# Altium schematic sheet Memory.SchDoc
size A; SheetNumber: 2; SheetTotal: 6
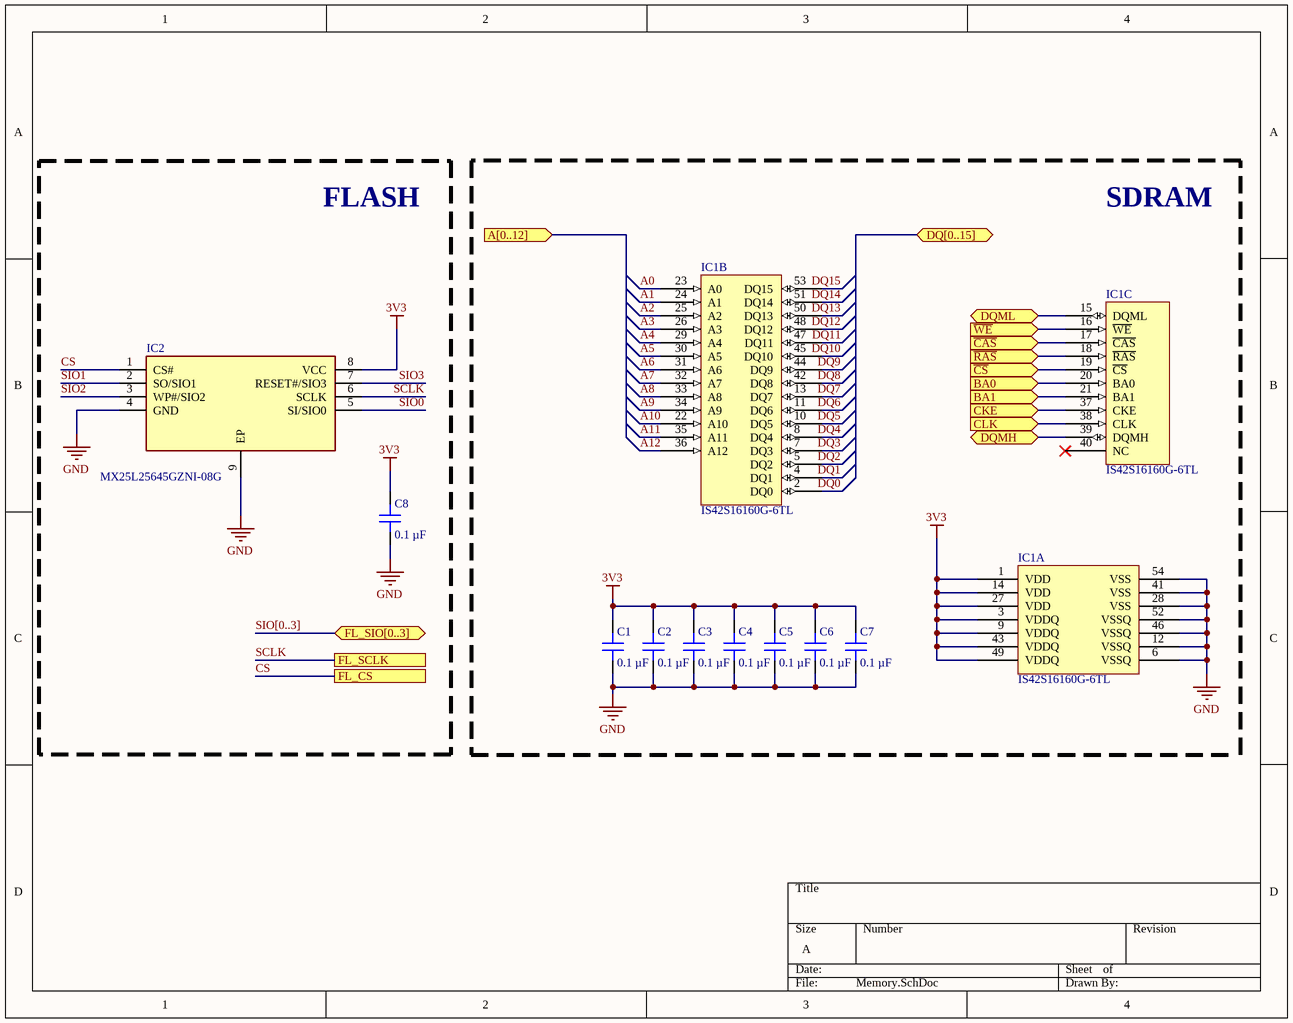
[diagram p0: Memory.SchDoc]

## Parts
C1  0.1 µF  [CAP 0603_1608]
C2  0.1 µF  [CAP 0603_1608]
C3  0.1 µF  [CAP 0603_1608]
C4  0.1 µF  [CAP 0603_1608]
C5  0.1 µF  [CAP 0603_1608]
C6  0.1 µF  [CAP 0603_1608]
C7  0.1 µF  [CAP 0603_1608]
C8  0.1 µF  [CAP 0603_1608]
IC1  IS42S16160G-6TL  [SOP80P1176X120-54N]  (parts A,B,C of 3)
IC2  MX25L25645GZNI-08G  [SON127P600X500X80-9N-D]

## Blocks framed on the sheet
FLASH: C8 IC2

## Ports
A[0..12] (in, see Motherboard[1A], STM32F7[1A]), BA0 (in, see Motherboard[1A], STM32F7[1A]), BA1 (in, see Motherboard[1A], STM32F7[1A]), CKE (in, see Motherboard[1A], STM32F7[1A]), CLK (in, see Motherboard[1A], STM32F7[1A]), DQ[0..15] (bidir, see Motherboard[1A], STM32F7[1A]), DQMH (bidir, see Motherboard[1A], STM32F7[2A]), DQML (bidir, see Motherboard[1A], STM32F7[2A]), FL_CS (see Motherboard[1B], STM32F7[1A]), FL_SCLK (see Motherboard[1B], STM32F7[1A]), FL_SIO[0..3] (bidir, see Motherboard[1A], STM32F7[1A]), ~{CAS} (in, see Motherboard[1A], STM32F7[2A]), ~{CS} (in, see Motherboard[1A], STM32F7[2A]), ~{RAS} (in, see Motherboard[1A], STM32F7[2A]), ~{WE} (in, see Motherboard[1A], STM32F7[2A])

## Nets
3V3: C1.2 C2.2 C3.2 C4.2 C5.2 C6.2 C7.2 C8.2 IC1.1(VDD) IC1.3(VDDQ) IC1.9(VDDQ) IC1.14(VDD) IC1.27(VDD) IC1.43(VDDQ) IC1.49(VDDQ) IC2.8(VCC)
GND: C1.1 C2.1 C3.1 C4.1 C5.1 C6.1 C7.1 C8.1 IC1.6(VSSQ) IC1.12(VSSQ) IC1.28(VSS) IC1.41(VSS) IC1.46(VSSQ) IC1.52(VSSQ) IC1.54(VSS) IC2.4(GND) IC2.9(EP)
~{CAS}: IC1.17(~{CAS}) ; port ~{CAS}
~{CS}: IC1.19(~{CS}) ; port ~{CS}
~{RAS}: IC1.18(~{RAS}) ; port ~{RAS}
~{WE}: IC1.16(~{WE}) ; port ~{WE}
A0: IC1.23(A0)
A1: IC1.24(A1)
A2: IC1.25(A2)
A3: IC1.26(A3)
A4: IC1.29(A4)
A5: IC1.30(A5)
A6: IC1.31(A6)
A7: IC1.32(A7)
A8: IC1.33(A8)
A9: IC1.34(A9)
A10: IC1.22(A10)
A11: IC1.35(A11)
A12: IC1.36(A12)
BA0: IC1.20(BA0) ; port BA0
BA1: IC1.21(BA1) ; port BA1
CKE: IC1.37(CKE) ; port CKE
CLK: IC1.38(CLK) ; port CLK
CS: IC2.1(CS#) ; port FL_CS
DQ0: IC1.2(DQ0)
DQ1: IC1.4(DQ1)
DQ2: IC1.5(DQ2)
DQ3: IC1.7(DQ3)
DQ4: IC1.8(DQ4)
DQ5: IC1.10(DQ5)
DQ6: IC1.11(DQ6)
DQ7: IC1.13(DQ7)
DQ8: IC1.42(DQ8)
DQ9: IC1.44(DQ9)
DQ10: IC1.45(DQ10)
DQ11: IC1.47(DQ11)
DQ12: IC1.48(DQ12)
DQ13: IC1.50(DQ13)
DQ14: IC1.51(DQ14)
DQ15: IC1.53(DQ15)
DQMH: IC1.39(DQMH) ; port DQMH
DQML: IC1.15(DQML) ; port DQML
SCLK: IC2.6(SCLK) ; port FL_SCLK
SIO0: IC2.5(SI/SIO0)
SIO1: IC2.2(SO/SIO1)
SIO2: IC2.3(WP#/SIO2)
SIO3: IC2.7(RESET#/SIO3)

Not connected (* = marked no-connect by the designer): IC1 40(NC)*

## Buses and harness runs
bus SIO[0..3] = port FL_SIO[0..3]

## Notes on the sheet
- SDRAM

## Library data of the parts
C1-C8 = 0603B104K101CT: CAP CER 0.1UF 100V X7R 0603; manufacturer: Walsin Technology Corporation; Tolerance: ±10%; Part Number: 0603B104K101CT; Value: 0.1 µF; Applications: General Purpose; Capacitance: 0.1 µF; componentlink1description: Datasheet; componentlink1url: http://www.passivecomponent.com/wp-content/uploads/2018/10/MLCC.pdf; componentlink2description: DigiKey Link; componentlink2url: https://www.digikey.com/en/products/detail/walsin-technology-corporation/0603B104K101CT/9354889; Device Package: 0603 (1608 Metric); lastupdated: 4/8/2023 7:09:18 PM; Lifecycle Status: Active; Minimum Order: 1; Mounting Type: Surface Mount, MLCC; Operating Temperature: -55°C ~ 125°C; Package / Case: 0603 (1608 Metric); packaging: TapeAndReel; partid: 4273; Part Status: Active; price: 0.01; series: -; Size / Dimension: 0.063" L x 0.031" W (1.60mm x 0.80mm); Supplier 1: DigiKey; Supplier Part Number 1: 1292-1392-1-ND; Temperature Coefficient: X7R; Thickness (Max): 0.037" (0.95mm); Voltage - Rated: 100V
IC1 = IS42S16160G-6TL: Integrated Circuit; Manufacturer_Name: Integrated Silicon Solution Inc.; Datasheet Link: http://www.issi.com/WW/pdf/42-45S83200G-16160G.pdf; Height: 1.2mm; Manufacturer_Part_Number: IS42S16160G-6TL; Mouser Part Number: 870-IS42S16160G-6TL; Mouser Price/Stock: https://www.mouser.co.uk/ProductDetail/ISSI/IS42S16160G-6TL?qs=9hm%252BDT1Jr7z36E7PiUiieg%3D%3D; Arrow Part Number: IS42S16160G-6TL; Arrow Price/Stock: https://www.arrow.com/en/products/is42s16160g-6tl/integrated-silicon-solution-inc
IC2 = MX25L25645GZNI-08G: Integrated Circuit; Manufacturer_Name: Macronix; Datasheet Link: https://www.macronix.com/Lists/Datasheet/Attachments/7858/MX25L25645G,%203V,%20256Mb,%20v1.9.pdf; Height: 0.8mm; Manufacturer_Part_Number: MX25L25645GZNI-08G; Arrow Part Number: MX25L25645GZNI-08G; Arrow Price/Stock: https://www.arrow.com/en/products/mx25l25645gzni-08g/macronix-international?region=nac